# EAGLE schematic esp_teensy_bridge (EAGLE 9.6.2)
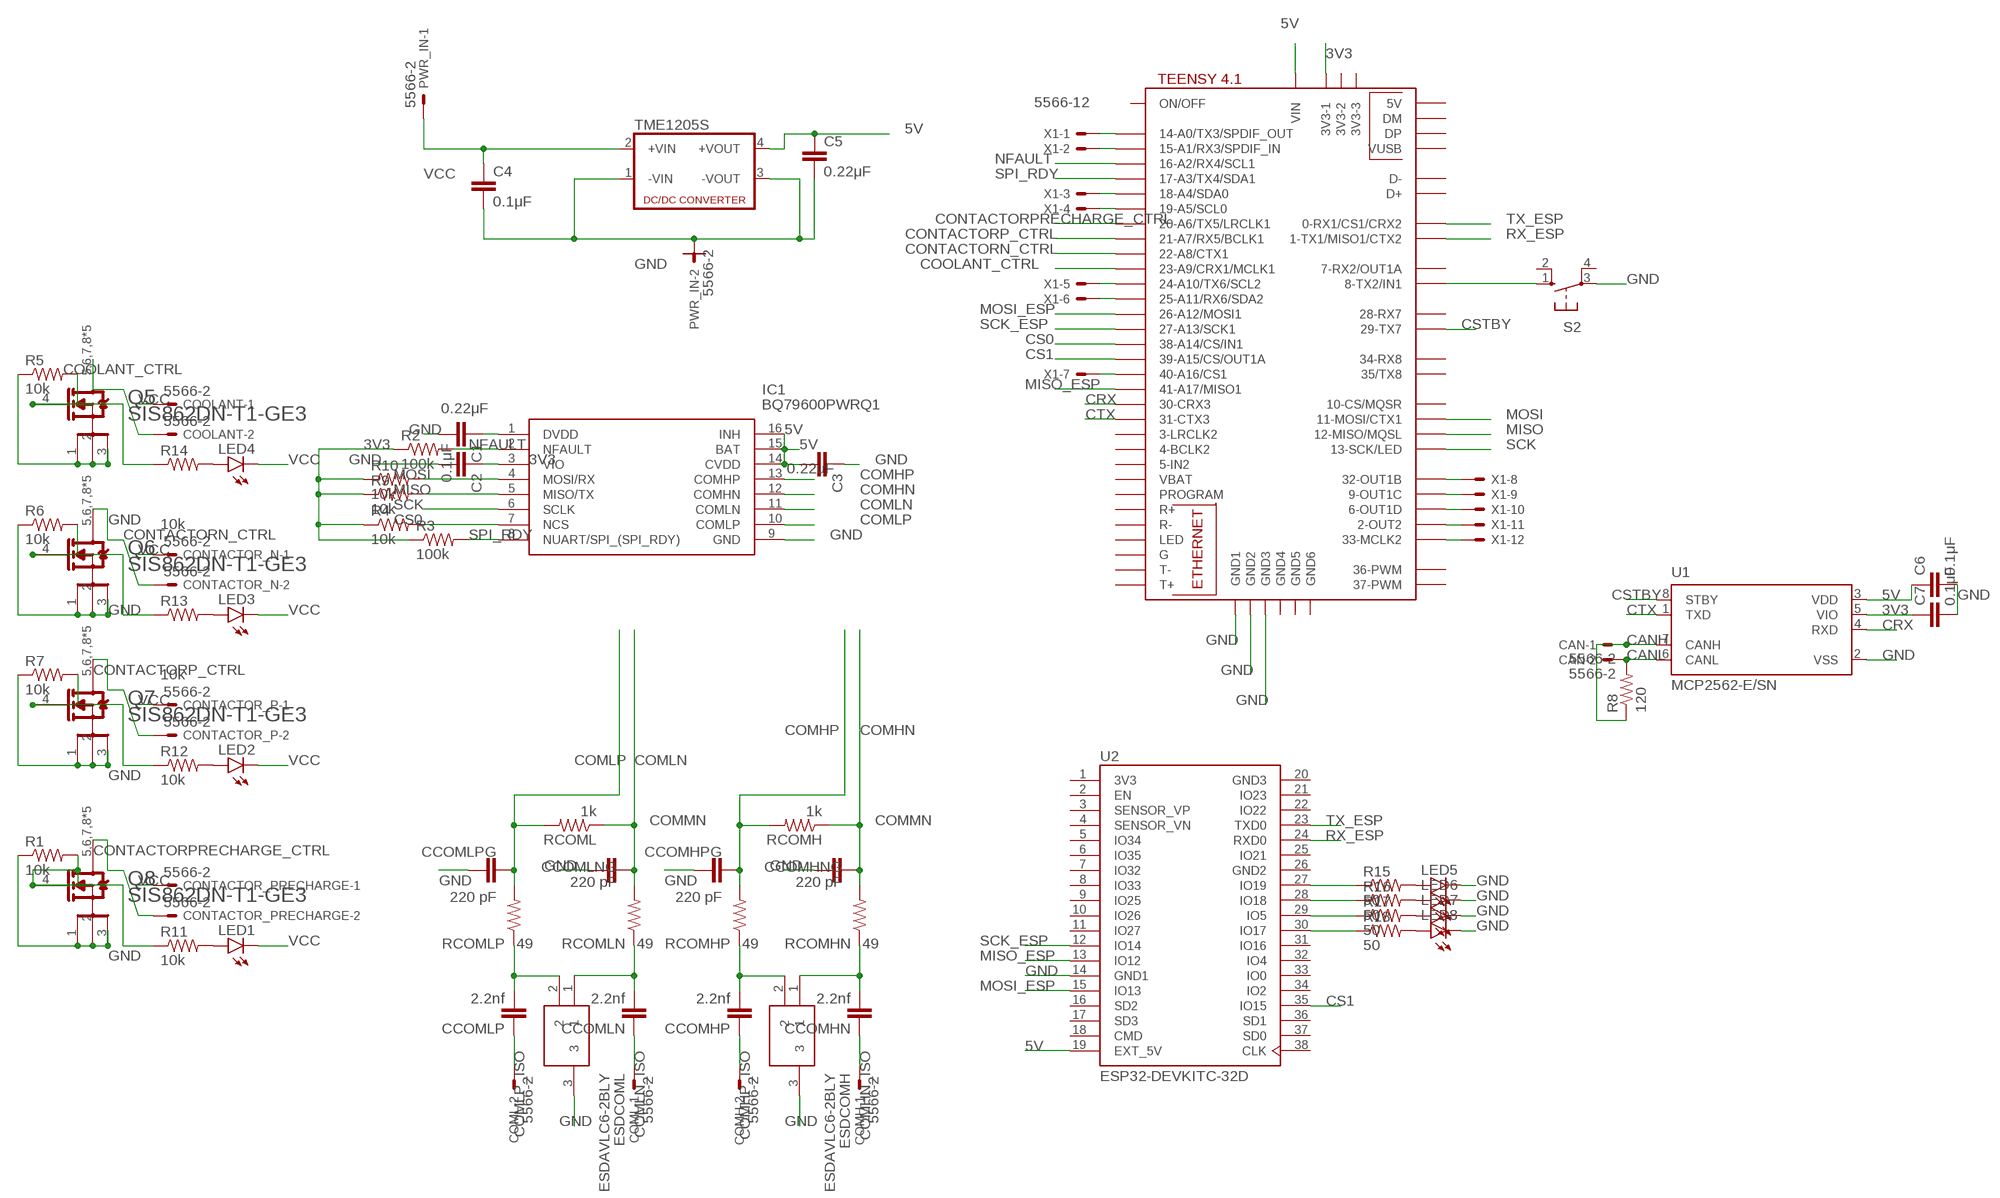
[diagram p0: schematic, sheet 1]

## Parts
C1  0.22μF  C-EUC0603  [C0603]
C2  0.1μF  C-EUC0603  [C0603]
C3  0.22uF  C-EUC0603  [C0603]
C4  0.1μF  C-EUC0603  [C0603]
C5  0.22μF  C-EUC0603  [C0603]
C6  0.1μF  C-EUC0603  [C0603]
C7  0.1μF  C-EUC0603  [C0603]
CAN  5566-2  [5566-2]
CCOMHN  2.2nf  C-EUC0603  [C0603]
CCOMHNG  220 pF  C-EUC0603  [C0603]
CCOMHP  2.2nf  C-EUC0603  [C0603]
CCOMHPG  220 pF  C-EUC0603  [C0603]
CCOMLN  2.2nf  C-EUC0603  [C0603]
CCOMLNG  220 pF  C-EUC0603  [C0603]
CCOMLP  2.2nf  C-EUC0603  [C0603]
CCOMLPG  220 pF  C-EUC0603  [C0603]
COMH  5566-2  [5566-2]
COML  5566-2  [5566-2]
CONTACTOR_N  5566-2  [5566-2]
CONTACTOR_P  5566-2  [5566-2]
CONTACTOR_PRECHARGE  5566-2  [5566-2]
COOLANT  5566-2  [5566-2]
ESDCOMH  ESDAVLC6-2BLY  [SOT95P255X150-3N]
ESDCOML  ESDAVLC6-2BLY  [SOT95P255X150-3N]
IC1  BQ79600PWRQ1  [SOP65P640X120-16N]
LED1  LEDSML0603  [SML0603]
LED2  LEDSML0603  [SML0603]
LED3  LEDSML0603  [SML0603]
LED4  LEDSML0603  [SML0603]
LED5  LEDSML0603  [SML0603]
LED6  LEDSML0603  [SML0603]
LED7  LEDSML0603  [SML0603]
LED8  LEDSML0603  [SML0603]
PWR_IN  5566-2  [5566-2]
Q5  VISHAY_SIS862DN-T1-GE3VISHAY_SIS862DN-T1-GE3_0_0  [VISHAY_SIS862DN-T1-GE3_0]
Q6  VISHAY_SIS862DN-T1-GE3VISHAY_SIS862DN-T1-GE3_0_0  [VISHAY_SIS862DN-T1-GE3_0]
Q7  VISHAY_SIS862DN-T1-GE3VISHAY_SIS862DN-T1-GE3_0_0  [VISHAY_SIS862DN-T1-GE3_0]
Q8  VISHAY_SIS862DN-T1-GE3VISHAY_SIS862DN-T1-GE3_0_0  [VISHAY_SIS862DN-T1-GE3_0]
R1  10k  R-US_R0603  [R0603]
R2  100k  R-US_R0603  [R0603]
R3  100k  R-US_R0603  [R0603]
R4  10k  R-US_R0603  [R0603]
R5  10k  R-US_R0603  [R0603]
R6  10k  R-US_R0603  [R0603]
R7  10k  R-US_R0603  [R0603]
R8  120  R-US_R0603  [R0603]
R9  10k  R-US_R0603  [R0603]
R10  10k  R-US_R0603  [R0603]
R11  10k  R-US_R0603  [R0603]
R12  10k  R-US_R0603  [R0603]
R13  10k  R-US_R0603  [R0603]
R14  10k  R-US_R0603  [R0603]
R15  50  R-US_R0603  [R0603]
R16  50  R-US_R0603  [R0603]
R17  50  R-US_R0603  [R0603]
R18  50  R-US_R0603  [R0603]
RCOMH  1k  R-US_R0603  [R0603]
RCOMHN  49  R-US_R0603  [R0603]
RCOMHP  49  R-US_R0603  [R0603]
RCOML  1k  R-US_R0603  [R0603]
RCOMLN  49  R-US_R0603  [R0603]
RCOMLP  49  R-US_R0603  [R0603]
S2  10-XX  [B3F-10XX]
TME1205S  NME  [NME]
U1  MCP2562-E/SN  [SOIC127P600X175-8N]
U2  ESP32-DEVKITC-32D  [MODULE_ESP32-DEVKITC-32D]
U$3  TEENSY41  [TEENSY41]
X1  5566-12  [5566-12]

## Nets
3V3: C2.1 C7.1 IC1.3(VIO) R2.1 R3.1 R4.1 R9.1 R10.1 U1.5(VIO) U$3.3V3-1
5V: C3.2 C5.1 C6.1 IC1.14(CVDD) IC1.15(BAT) IC1.16(INH) TME1205S.4(+VOUT) U1.3(VDD) U2.19(EXT_5V) U$3.VIN
CANH: CAN.1 R8.1 U1.7(CANH)
CANL: CAN.2 R8.2 U1.6(CANL)
COMHN: CCOMHNG.2 IC1.12(COMHN) RCOMH.1 RCOMHN.2
COMHN_ISO: CCOMHN.1 COMH.1
COMHP: CCOMHPG.2 IC1.13(COMHP) RCOMH.2 RCOMHP.2
COMHP_ISO: CCOMHP.1 COMH.2
COMLN: CCOMLNG.2 IC1.11(COMLN) RCOML.1 RCOMLN.2
COMLN_ISO: CCOMLN.1 COML.1
COMLP: CCOMLPG.2 IC1.10(COMLP) RCOML.2 RCOMLP.2
COMLP_ISO: CCOMLP.1 COML.2
CONTACTORN_CTRL: Q6.4(G) R6.2 R13.1 U$3.22-A8/CTX1
CONTACTORP_CTRL: Q7.4(G) R7.2 R12.1 U$3.21-A7/RX5/BCLK1
CONTACTORPRECHARGE_CTRL: Q8.4(G) R1.2 R11.1 U$3.20-A6/TX5/LRCLK1
COOLANT_CTRL: Q5.4(G) R5.2 R14.1 U$3.23-A9/CRX1/MCLK1
CRX: U1.4(RXD) U$3.30-CRX3
CS0: IC1.7(NCS) R4.2 U$3.38-A14/CS/IN1
CS1: U2.35(IO15) U$3.39-A15/CS/OUT1A
CSTBY: U1.8(STBY) U$3.29-TX7
CTX: U1.1(TXD) U$3.31-CTX3
GND: C1.2 C2.2 C3.1 C4.2 C5.2 C6.2 C7.2 CCOMHNG.1 CCOMHPG.1 CCOMLNG.1 CCOMLPG.1 ESDCOMH.3 ESDCOML.3 IC1.9(GND) LED5.C LED6.C LED7.C LED8.C PWR_IN.2 Q5.1(1_S) Q5.2(2_S) Q5.3(3_S) Q6.1(1_S) Q6.2(2_S) Q6.3(3_S) Q7.1(1_S) Q7.2(2_S) Q7.3(3_S) Q8.1(1_S) Q8.2(2_S) Q8.3(3_S) R1.1 R5.1 R6.1 R7.1 S2.3(P) TME1205S.1(-VIN) TME1205S.3(-VOUT) U1.2(VSS) U2.14(GND1) U$3.GND1 U$3.GND2 U$3.GND3
MISO: IC1.5(MISO/TX) R9.2 U$3.12-MISO/MQSL
MISO_ESP: U2.13(IO12) U$3.41-A17/MISO1
MOSI: IC1.4(MOSI/RX) R10.2 U$3.11-MOSI/CTX1
MOSI_ESP: U2.15(IO13) U$3.26-A12/MOSI1
N$1: C1.1 IC1.1(DVDD)
N$2: CONTACTOR_N.2 Q6.5,6,7,8(D) Q6.5,6,7,8-2(D) Q6.5,6,7,8-3(D) Q6.5,6,7,8-4(D) Q6.5,6,7,8-5(D)
N$3: LED1.A R11.2
N$4: LED2.A R12.2
N$5: COOLANT.2 Q5.5,6,7,8(D) Q5.5,6,7,8-2(D) Q5.5,6,7,8-3(D) Q5.5,6,7,8-4(D) Q5.5,6,7,8-5(D)
N$6: CONTACTOR_PRECHARGE.2 Q8.5,6,7,8(D) Q8.5,6,7,8-2(D) Q8.5,6,7,8-3(D) Q8.5,6,7,8-4(D) Q8.5,6,7,8-5(D)
N$7: S2.1(S) U$3.8-TX2/IN1
N$9: LED3.A R13.2
N$10: CCOMLP.2 ESDCOML.2 RCOMLP.1
N$11: CCOMLN.2 ESDCOML.1 RCOMLN.1
N$12: CONTACTOR_P.2 Q7.5,6,7,8(D) Q7.5,6,7,8-2(D) Q7.5,6,7,8-3(D) Q7.5,6,7,8-4(D) Q7.5,6,7,8-5(D)
N$13: LED4.A R14.2
N$14: U$3.14-A0/TX3/SPDIF_OUT X1.1
N$15: CCOMHP.2 ESDCOMH.2 RCOMHP.1
N$16: CCOMHN.2 ESDCOMH.1 RCOMHN.1
N$17: U$3.15-A1/RX3/SPDIF_IN X1.2
N$18: U$3.18-A4/SDA0 X1.3
N$19: U$3.19-A5/SCL0 X1.4
N$20: U$3.24-A10/TX6/SCL2 X1.5
N$21: U$3.25-A11/RX6/SDA2 X1.6
N$22: U$3.40-A16/CS1 X1.7
N$23: U$3.32-OUT1B X1.8
N$24: U$3.9-OUT1C X1.9
N$25: U$3.6-OUT1D X1.10
N$26: U$3.33-MCLK2 X1.12
N$27: U$3.2-OUT2 X1.11
N$28: R15.1 U2.27(IO19)
N$29: R16.1 U2.28(IO18)
N$30: R17.1 U2.29(IO5)
N$31: R18.1 U2.30(IO17)
N$32: LED5.A R15.2
N$33: LED6.A R16.2
N$34: LED7.A R17.2
N$35: LED8.A R18.2
NFAULT: IC1.2(NFAULT) R2.2 U$3.16-A2/RX4/SCL1
RX_ESP: U2.24(RXD0) U$3.1-TX1/MISO1/CTX2
SCK: IC1.6(SCLK) U$3.13-SCK/LED
SCK_ESP: U2.12(IO14) U$3.27-A13/SCK1
SPI_RDY: IC1.8(NUART/SPI_(SPI_RDY)) R3.2 U$3.17-A3/TX4/SDA1
TX_ESP: U2.23(TXD0) U$3.0-RX1/CS1/CRX2
VCC: C4.1 CONTACTOR_N.1 CONTACTOR_P.1 CONTACTOR_PRECHARGE.1 COOLANT.1 LED1.C LED2.C LED3.C LED4.C PWR_IN.1 TME1205S.2(+VIN)
Unconnected: S2.2(S1) S2.4(P1) U2.2(EN) U2.3(SENSOR_VP) U2.4(SENSOR_VN) U2.5(IO34) U2.6(IO35) U2.7(IO32) U2.8(IO33) U2.9(IO25) U2.10(IO26) U2.11(IO27) U2.16(SD2) U2.17(SD3) U2.18(CMD) U2.21(IO23) U2.22(IO22) U2.25(IO21) U2.31(IO16) U2.32(IO4) U2.33(IO0) U2.34(IO2) U2.36(SD1) U2.37(SD0) U2.38(CLK) U$3.3-LRCLK2 U$3.3V3-2 U$3.3V3-3 U$3.4-BCLK2 U$3.5-IN2 U$3.7-RX2/OUT1A U$3.10-CS\MQSR(10-CS/MQSR) U$3.28-RX7 U$3.34-RX8 U$3.35-TX8(35/TX8) U$3.36-PWM U$3.37-PWM U$3.+5V(5V) U$3.D+ U$3.D- U$3.DM U$3.DP U$3.G U$3.GND4 U$3.GND5 U$3.GND6 U$3.LED U$3.ON/OFF U$3.PROGRAM U$3.R+ U$3.R- U$3.T+ U$3.T- U$3.VBAT U$3.VUSB

## Power pins joined to a net without a drawn wire
3V3: U2.1(3V3)
GND2: U2.26(GND2)
GND3: U2.20(GND3)

## Library data of the parts
C1-C7 CCOMHN CCOMHNG CCOMHP CCOMHPG CCOMLN CCOMLNG CCOMLP CCOMLPG = rcl:C-EU: CAPACITOR, European symbol; SPICEPREFIX: C
CAN COMH COML CONTACTOR_N CONTACTOR_P CONTACTOR_PRECHARGE COOLANT PWR_IN = con-molex:5566-2: Mini FIT connector 2 pol Source: http://www.molex.com; MF: MOLEX; OC_FARNELL: 1822072; OC_NEWARK: unknown
ESDCOMH ESDCOML = ESDAVLC6-2BLY:ESDAVLC6-2BLY: STMICROELECTRONICS - ESDAVLC6-2BLY - ESD Protection Device, 17 V, SOT-23, 3 Pins, 5 V, 140 W, ESDA Transil Series Source: Datasheet <http://www.st.com/resource/en/datasheet/esdavlc6-2bly.pdf>; DESCRIPTION: STMICROELECTRONICS - ESDAVLC6-2BLY - ESD Protection Device, 17 V, SOT-23, 3 Pins, 5 V, 140 W, ESDA Transil Series; HEIGHT: 1.5mm; MANUFACTURER_NAME: STMicroelectronics; MANUFACTURER_PART_NUMBER: ESDAVLC6-2BLY; MOUSER_PART_NUMBER: 511-ESDAVLC6-2BLY; MOUSER_PRICE-STOCK: https://www.mouser.co.uk/ProductDetail/STMicroelectronics/ESDAVLC6-2BLY?qs=l7cgNqFNU1iH2e21evvYsA%3D%3D
IC1 = BQ79600:BQ79600PWRQ1: Battery Management Automotive SPI/UART communication interface functional-safety compliant with automatic host wakeup Source: Datasheet <https://www.arrow.com/en/products/bq79600pwrq1/texas-instruments>; DESCRIPTION: Battery Management Automotive SPI/UART communication interface functional-safety compliant with automatic host wakeup; HEIGHT: 1.2mm; MANUFACTURER_NAME: Texas Instruments; MANUFACTURER_PART_NUMBER: BQ79600PWRQ1; MOUSER_PART_NUMBER: 595-BQ79600PWRQ1; MOUSER_PRICE-STOCK: https://www.mouser.co.uk/ProductDetail/Texas-Instruments/BQ79600PWRQ1?qs=bAKSY%2FctAC74v4PXQeVHrA%3D%3D
LED1-LED8 = led:LED: LED OSRAM: - CHIPLED LG R971, LG N971, LY N971, LG Q971, LY Q971, LO R971, LY R971 LH N974, LH R974 LS Q976, LO Q976, LY Q976 LO Q996 - Hyper CHIPLED LW Q18S LB Q993, LB Q99A, LB R99A - SideLED LS A670, LO A670, LY A670, LG A670, LP A670 LB A673, LV A673, LT A673, LW A673 LH A674 LY A675 LS A676, LA A676, LO A676, LY A676, LW A676 LS A679, LY A679, LG A679 - Hyper Micro SIDELED® LS Y876, LA Y876, LO Y876, LY Y876 LT Y87S - SmartLED LW L88C, LW L88S LB L89C, LB L89S, LG L890 LS L89K, LO L89K, LY L89K LS L896, LA L896, LO L896, LY L896 - TOPLED LS T670, LO T670, LY T670, LG T670, LP T670 LSG T670, LSP T670, LSY T670, LOP T670, LYG T670 LG T671, LOG T671, LSG T671 LB T673, LV T673, LT T673, LW T673 LH T674 LS T676, LA T676, LO T676, LY T676, LB T676, LH T676, LSB T676, LW T676 LB T67C, LV T67C, LT T67C, LS T67K, LO T67K, LY T67K, LW E67C LS E67B, LA E67B, LO E67B, LY E67B, LB E67C, LV E67C, LT E67C LW T67C LS T679, LY T679, LG T679 LS T770, LO T770, LY T770, LG T770, LP T770 LB T773, LV T773, LT T773, LW T773 LH T774 LS E675, LA E675, LY E675, LS T675 LS T776, LA T776, LO T776, LY T776, LB T776 LHGB T686 LT T68C, LB T68C - Hyper Mini TOPLED® LB M676 - Mini TOPLED Santana® LG M470 LS M47K, LO M47K, LY M47K Source: http://www.osram.convergy.de LUXEON: - LUMILED® LXK2-PW12-R00, LXK2-PW12-S00, LXK2-PW14-U00, LXK2-PW14-V00 LXK2-PM12-R00, LXK2-PM12-S00, LXK2-PM14-U00 LXK2-PE12-Q00, LXK2-PE12-R00, LXK2-PE12-S00, LXK2-PE14-T00, LXK2-PE14-U00 LXK2-PB12-K00, LXK2-PB12-L00, LXK2-PB12-M00, LXK2-PB14-N00, LXK2-PB14-P00, LXK2-PB14-Q00 LXK2-PR12-L00, LXK2-PR12-M00, LXK2-PR14-Q00, LXK2-PR14-R00 LXK2-PD12-Q00, LXK2-PD12-R00, LXK2-PD12-S00 LXK2-PH12-R00, LXK2-PH12-S00 LXK2-PL12-P00, LXK2-PL12-Q00, LXK2-PL12-R00 Source: www.luxeon.com KINGBRIGHT: KA-3528ASYC Source: www.kingbright.com
Q5-Q8 = Vishay - SIS862DN-T1-GE3:VISHAY_SIS862DN-T1-GE3: MOSFET Transistor, N Channel, 40 A, 60 V, 0.007 ohm, 10 V; CENTROID_NOT_SPECIFIED: No; CONTINUOUS_DRAIN_CURRENT: 40A; DATASHEET: http://www.vishay.com/docs/63346/sis862dn.pdf; DEVICE_CLASS_L1: Discrete Semiconductors; DEVICE_CLASS_L2: Transistors; DEVICE_CLASS_L3: MOSFETs; DIGIKEY_DESCRIPTION: TRANS MOSFET N-CH 60V 40A 1212; DIGIKEY_PART_NUMBER: SIS862DN-T1-GE3CT-ND; DRAIN_TO_SOURCE_BREAKDOWN_VOLTAGE: 60V; DRAIN_TO_SOURCE_RESISTANCE: 0.007Ω; DRAIN_TO_SOURCE_VOLTAGE: 60V; GATE_TO_SOURCE_VOLTAGE: 20V; HEIGHT: 1.12mm; INPUT_CAPACITACE_AT_VDS: 1320pF @ 30V; LEAD_FREE: yes; MAX_JUNCTION_TEMP: +150°C; MF: Vishay; MFG_PACKAGE_IDENT: S16-2667; MFG_PACKAGE_IDENT_DATE: 01/2017; MFG_PACKAGE_IDENT_REV: M; MOUSER_DESCRIPTION: N-Channel 60 V 8.5 mOhm 52 W TrenchFET Power Mosfet - PowerPAK 1212-8; MOUSER_PART_NUMBER: 78-SIS862DN-T1-GE3; MPN: SIS862DN-T1-GE3; NUMBER_OF_CHANNELS: 1; NUMBER_OF_N_CHANNELS: 1; PACKAGE: PowerPAK1212-8; POWER_DISSIPATION: 52W; PREFIX: Q; ROHS: yes; STANDOFF_HEIGHT: 0mm; TECHNOLOGY: MOSFET; TEMPERATURE_RANGE_HIGH: +150°C; TEMPERATURE_RANGE_LOW: -55°C; THRESHOLD_VGS: 2.6V; TURN_OFF_DELAY_TIME: 15ns; TURN_ON_DELAY_TIME: 23ns; VERIFICATION_VERSION: 0.0.0.1
R1-R18 RCOMH RCOMHN RCOMHP RCOML RCOMLN RCOMLP = rcl:R-US_: RESISTOR, American symbol; SPICEPREFIX: R
S2 = switch-omron:10-XX: OMRON SWITCH; MPN: B3F-1000; OC_FARNELL: 176432; OC_NEWARK: 36M3542
TME1205S = dc-dc-converter:NME: DC-DC CONVERTER; MF: C & D TECHNOLOGIES, INC; MPN: NME1205D; OC_FARNELL: 1021466; OC_NEWARK: 98B8198
U1 = MCP2562-E_SN:MCP2562-E/SN: MCP2562 Series 5 V Surface Mount High-Speed CAN Transceiver - SOIC-8 Check availability <https://pricing.snapeda.com/parts/MCP2562-E/SN/Microchip/view-part?ref=eda>; AVAILABILITY: In Stock; DESCRIPTION: Microchip MCP2562-E/SN, CAN Transceiver 1MBps 1-channel IEC 61000-4-2, 8-Pin SOIC; MF: Microchip; MP: MCP2562-E/SN; PACKAGE: SO-8 Microchip; PRICE: None; PURCHASE-URL: https://pricing.snapeda.com/search/part/MCP2562-E/SN/?ref=eda
U2 = ESP32-DEVKITC-32D:ESP32-DEVKITC-32D: Eval Board For Esp-Wroom-32 Check availability <https://pricing.snapeda.com/parts/ESP32-DEVKITC-32D/Espressif%20Systems/view-part?ref=eda>; AVAILABILITY: In Stock; DESCRIPTION: WiFi Development Tools (802.11) ESP32 General Development Kit, ESP32-WROOM-32D on the board; MF: Espressif Systems; MP: ESP32-DEVKITC-32D; PACKAGE: None; PRICE: None; PURCHASE-URL: https://pricing.snapeda.com/search/part/ESP32-DEVKITC-32D/?ref=eda
U$3 = teensy:TEENSY41
X1 = con-molex:5566-12: Mini FIT connector 12 pol Source: http://www.molex.com; MF: MOLEX; OC_FARNELL: unknown; OC_NEWARK: unknown